# EAGLE design QdecLogic (EAGLE 7.5.0)
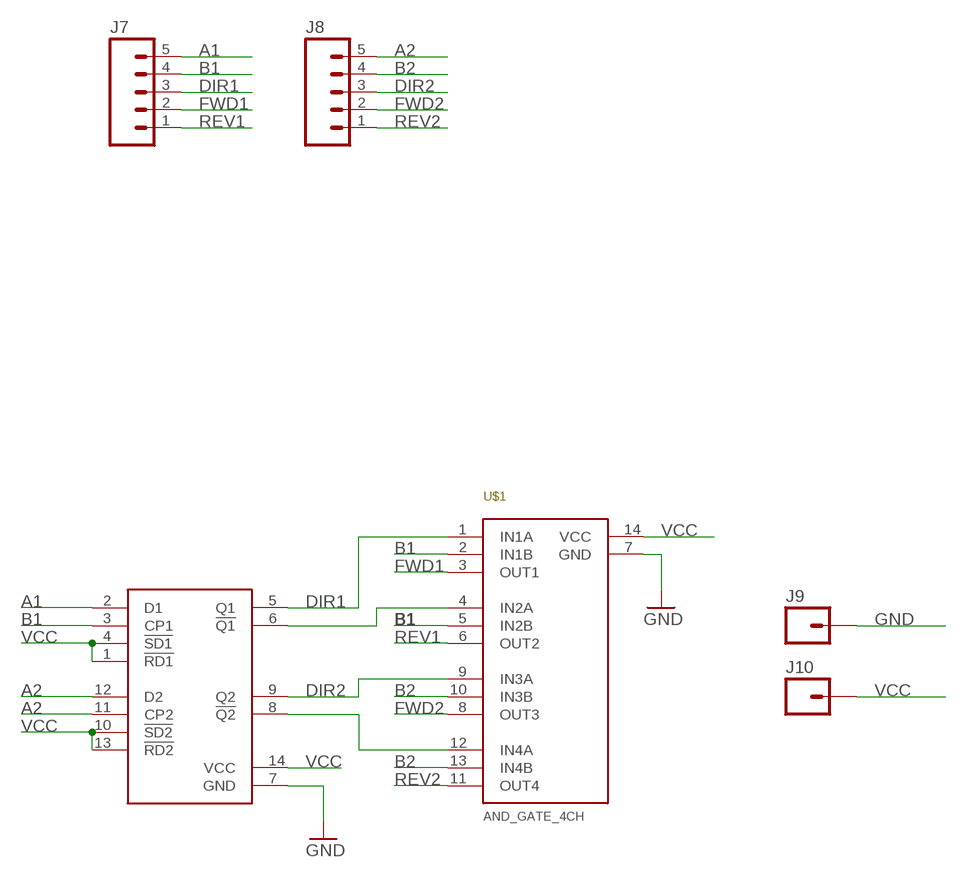
[diagram p0: schematic, sheet 1]

## Parts
J7  M05NO_SILK  [1X05_NO_SILK]
J8  M05NO_SILK  [1X05_NO_SILK]
J9  M01PTH_NO_SILK_YES_STOP  [1X01_NO_SILK]
J10  M01PTH_NO_SILK_YES_STOP  [1X01_NO_SILK]
U$1  AND_GATE_4CH  [14-SOIC]
U$2  FLIPFLOP_D-TYPE_2CH  [14-SOIC]

## Nets
A1: J7.5 U$2.2(D1)
A2: J8.5 U$2.12(D2)
B1: J7.4 U$1.2(IN1B) U$1.5(IN2B) U$2.3(CP1)
B2: J8.4 U$1.10(IN3B) U$1.13(IN4B) U$2.11(CP2)
DIR1: J7.3 U$1.1(IN1A) U$2.5(Q1)
DIR2: J8.3 U$1.9(IN3A) U$2.9(Q2)
FWD1: J7.2 U$1.3(OUT1)
FWD2: J8.2 U$1.8(OUT3)
GND: J9.1 U$1.7(GND) U$2.7(GND)
N$6: U$1.4(IN2A) U$2.6(!Q1)
N$8: U$1.12(IN4A) U$2.8(!Q2)
REV1: J7.1 U$1.6(OUT2)
REV2: J8.1 U$1.11(OUT4)
VCC: J10.1 U$1.14(VCC) U$2.1(!RD1) U$2.4(!SD1) U$2.10(!SD2) U$2.13(!RD2) U$2.14(VCC)

## Library data of the parts
J7 J8 = SparkFun-Connectors:M05: Header 5 Standard 5-pin 0.1" header. Use with straight break away headers (SKU : PRT-00116), right angle break away headers (PRT-00553), swiss pins (PRT-00743), machine pins (PRT-00117), and female headers (PRT-00115). Molex polarized connector foot print use with SKU : PRT-08230 with associated crimp pins and housings.
J9 J10 = SparkFun-Connectors:M01: Header 1 Standard 1-pin 0.1" header. Use with straight break away headers (SKU : PRT-00116), right angle break away headers (PRT-00553), swiss pins (PRT-00743), machine pins (PRT-00117), and female headers (PRT-00115). SMTSO-256-ET is a "flush mount" nut for a 4-40 screw. The older package used to be too tight, and did not allow it to sit properly thru the drill hit. The latest (0.165DIA) fits nice and snug.
U$1 = AmandaEagleLibrary:AND_GATE_4CH
U$2 = AmandaEagleLibrary:FLIPFLOP_D-TYPE_2CH

## Board
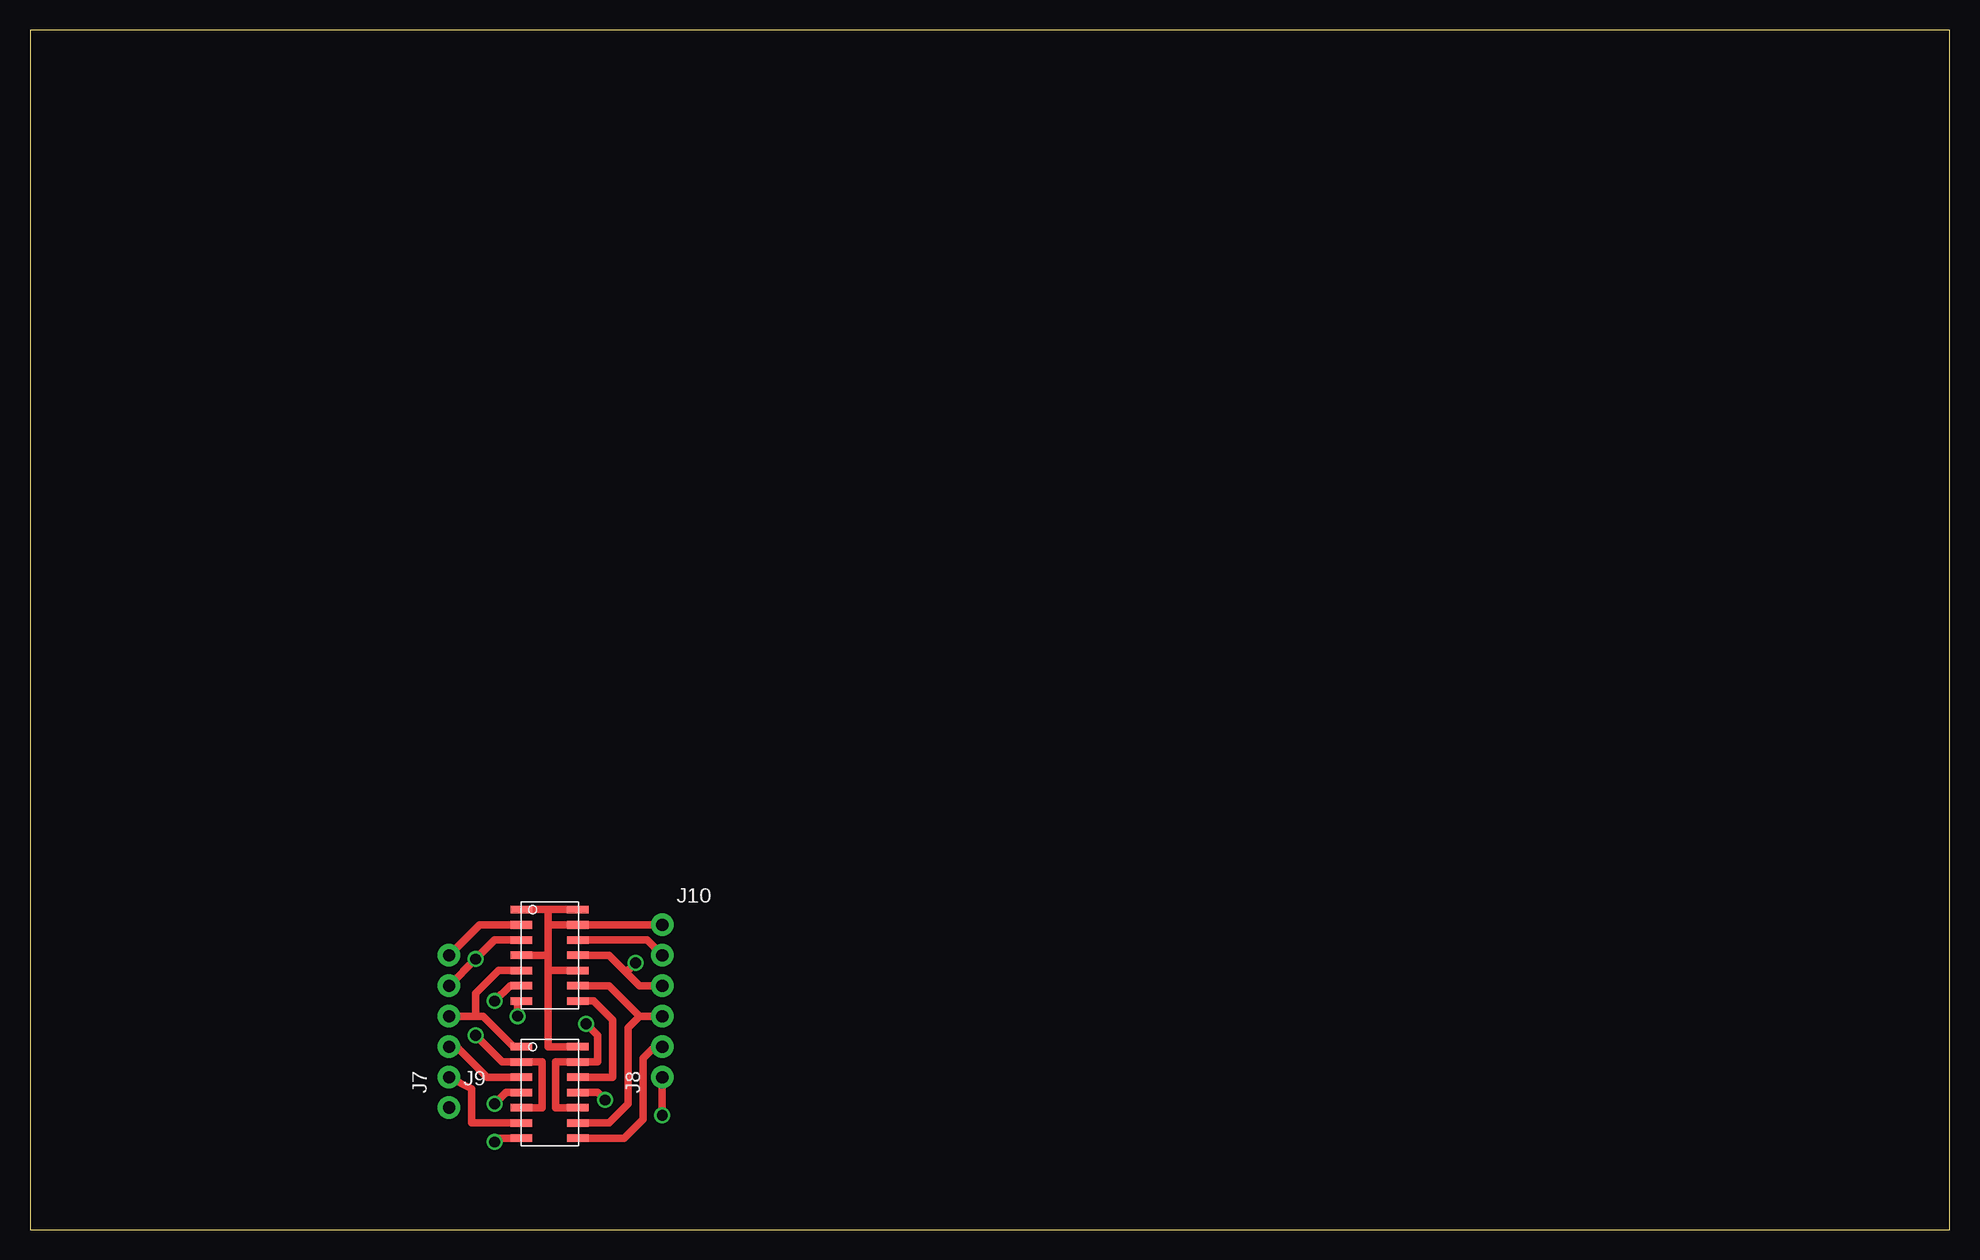
[diagram p1: board, top side]
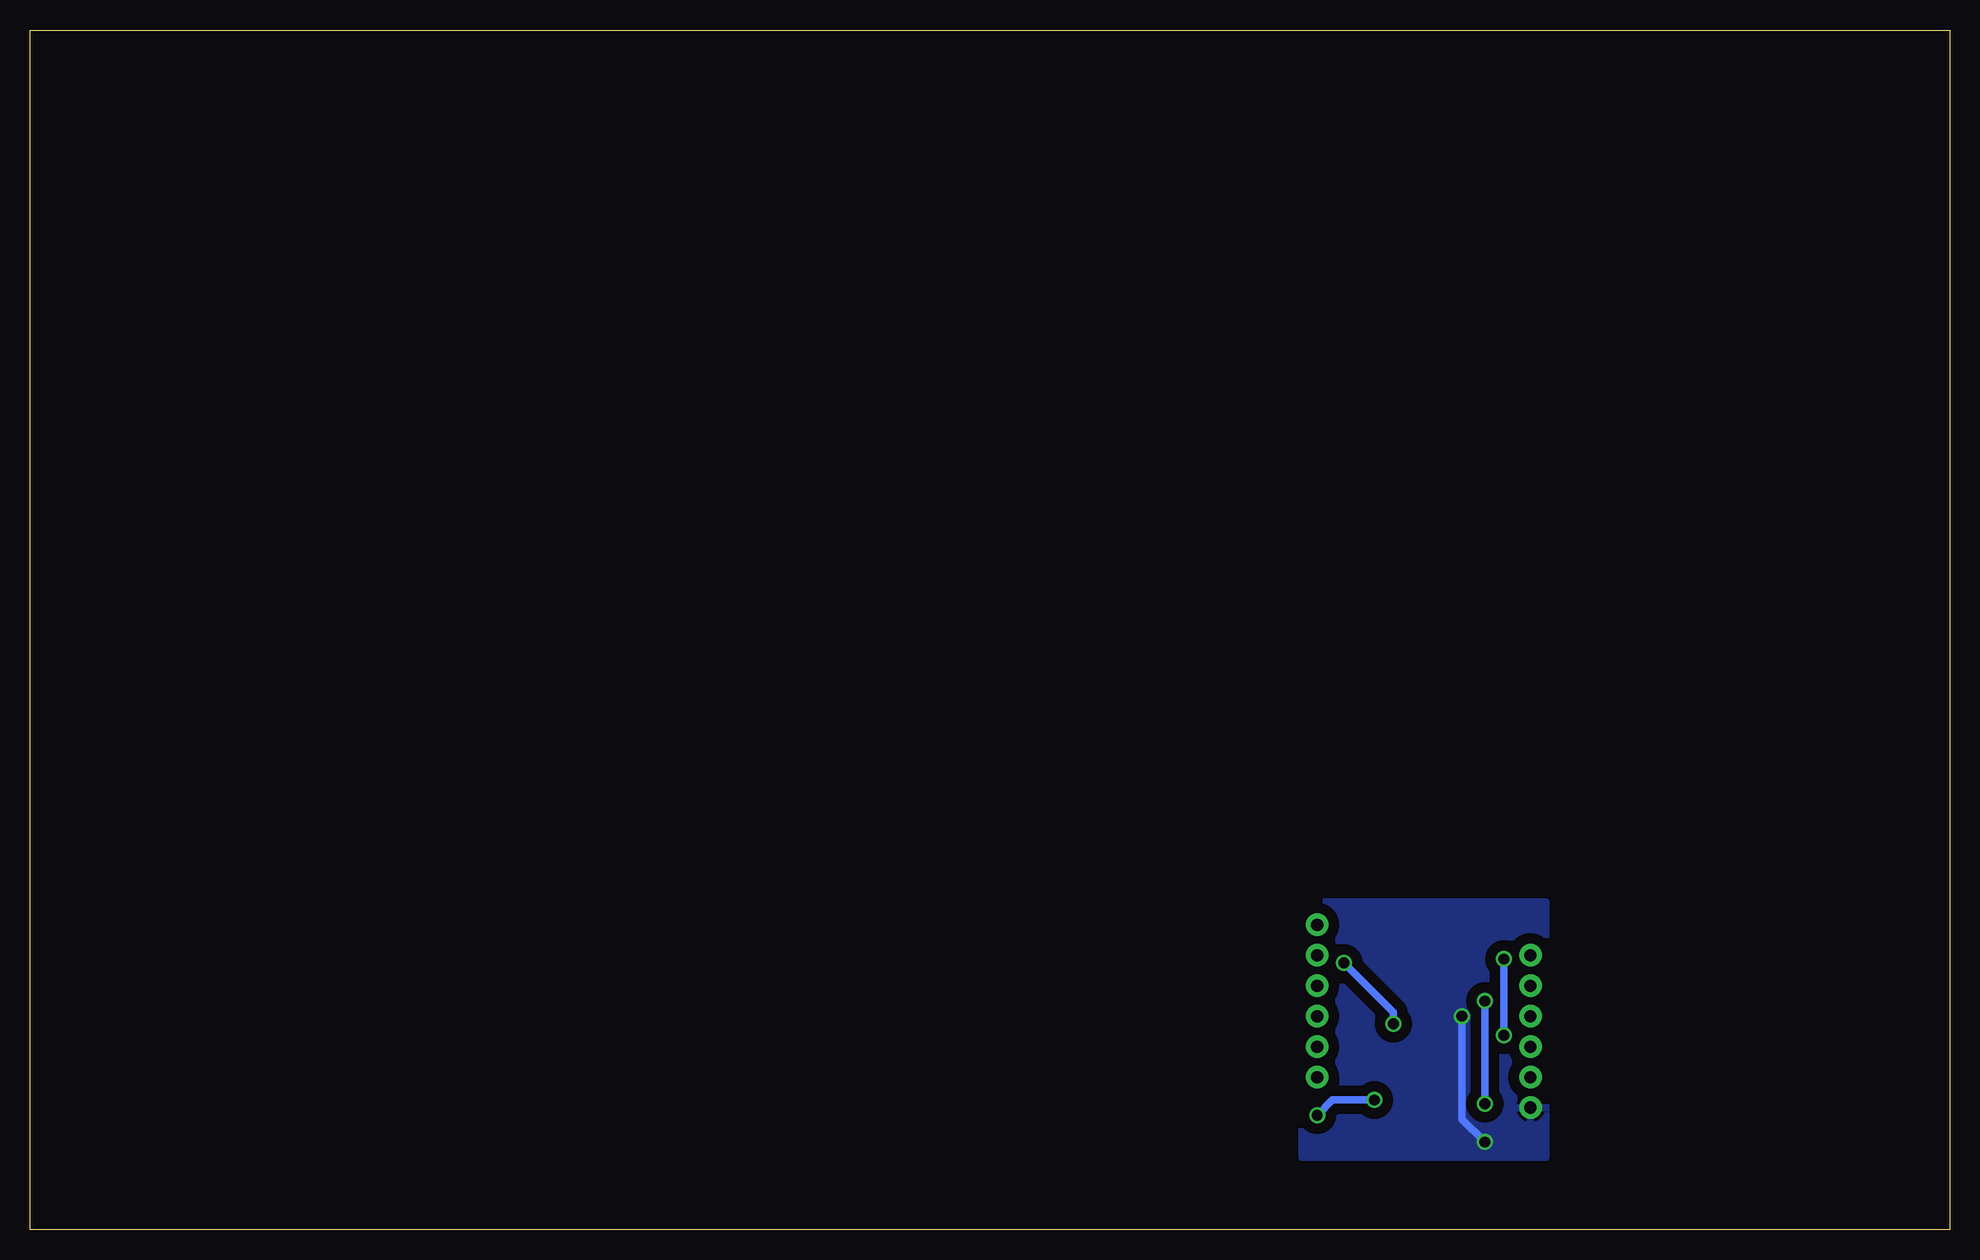
[diagram p2: board, bottom side, seen from below]

Size 160 x 100 mm. Coordinates in mm from the lower left corner, seen from the top.
Outline: 0,0 160,0 160,100 0,100 0,0
Copper layers (1*16): Top 0.035mm / dielectric 1.5mm / Bottom 0.035mm
Design rules "default": minimum track width 10mil, minimum drill 24mil, track to track 8mil, track to pad 8mil, pad to pad 8mil, via to via 8mil, smd to smd 8mil, copper to edge 40mil, drill to drill 8mil, minimum pad ring 10mil, minimum via ring 8mil, stop-mask expansion 4mil, vias tented up to drill 0mil, thermal gap 10mil

### Footprints (pad centres in the part's own frame; a part is rotated, then mirrored left to right if it is on the bottom)
1X05_NO_SILK = drill 1.016 pad 1.88: 1 0,0; 2 2.54,0; 3 5.08,0; 4 7.62,0; 5 10.16,0
1X01_NO_SILK = drill 1.016 pad 1.88: 1 0,0
14-SOIC = smd 1.778 x 0.635: 1 -2.223,3.81; 2 -2.223,2.54; 3 -2.223,1.27; 4 -2.223,0; 5 -2.223,-1.27; 6 -2.223,-2.54; 7 -2.223,-3.81; 8 2.477,-3.81; 9 2.477,-2.54; 10 2.477,-1.27; 11 2.477,0; 12 2.477,1.27; 13 2.477,2.54; 14 2.477,3.81

### Placement (x,y rotation side)
J7  34.92,12.7 90 top
J8  52.7,12.7 90 top
J9  34.92,10.16 0 top
J10  52.7,25.4 0 top
U$1  43.18,11.43 0 top
U$2  43.18,22.86 0 top

### Tracks (layer width: path | path; a pad name or v marks a point on that pad's centre or on a via)
A1
  Top 0.61: U$2.2 37.47,25.4 J7.5
A2
  Top 0.61: U$2.12 51.44,24.13 J8.5
B1  (via drill 0.89 pad 0.89)
  Top 0.61: U$1.5 42.7,10.16 42.7,13.97 U$1.2 39.37,13.97 v37.15,16.19 | U$2.3 38.73,24.13 v37.15,22.54 J7.4
  Bottom 0.61: v37.15,16.19 v37.15,22.54
B2  (via drill 0.89 pad 0.89)
  Top 0.61: U$1.10 43.81,10.16 43.81,13.97 U$1.13 47.31,13.97 47.31,16.19 v46.35,17.14 | U$2.11 48.26,22.86 49.69,21.43 | 49.69,21.43 50.8,20.32 J8.4 | v50.48,22.23 49.69,21.43
  Bottom 0.61: v46.35,17.14 46.35,18.1 v50.48,22.23
DIR1
  Top 0.61: U$1.1 40.32,15.24 37.78,17.78 37.15,17.78 | 37.15,17.78 J7.3 | U$2.5 39.05,21.59 37.15,19.68 37.15,17.78
DIR2
  Top 0.61: U$2.9 48.26,20.32 50.8,17.78 | 50.8,17.78 J8.3 | U$1.9 48.26,8.89 49.85,10.48 49.85,16.83 50.8,17.78
FWD1
  Top 0.61: U$1.3 38.1,12.7 35.56,15.24 J7.2
FWD2
  Top 0.61: U$1.8 49.53,7.62 51.12,9.21 51.12,14.29 52.07,15.24 J8.2
GND  (via drill 0.89, 0.89 pad 0.89)
  Top 0.61: U$2.7 40.64,19.05 v40.64,17.78 | U$1.7 39.05,7.62 v38.73,7.3
  Bottom 0.61: v38.73,7.3 40.64,9.21 v40.64,17.78
  pour Bottom (isolate 0.889): 33.97,27.3 53.98,27.3 53.98,6.03 33.66,6.03 33.66,27.3
N$6  (via drill 0.89 pad 0.89)
  Top 0.61: U$1.4 39.69,11.43 v38.73,10.48 | v38.73,19.05 40.01,20.32 U$2.6
  Bottom 0.61: v38.73,10.48 v38.73,19.05
N$8
  Top 0.61: U$2.8 46.99,19.05 48.58,17.46 48.58,12.7 U$1.12
REV1
  Top 0.61: U$1.6 36.83,8.89 36.83,11.75 J7.1
REV2  (via drill 0.89 pad 0.89)
  Top 0.61: U$1.11 47.31,11.43 v47.94,10.79 | v52.7,9.53 J8.1
  Bottom 0.61: v47.94,10.79 51.44,10.79 v52.7,9.53
VCC
  Top 0.61: U$2.4 43.18,22.86 | 43.18,22.86 43.18,25.4 | 43.18,25.4 U$2.13 J10.1 | 43.18,25.4 43.18,26.67 U$2.1 U$2.14 | 43.18,22.86 43.18,21.59 | 43.18,21.59 43.18,15.24 U$1.14 | U$2.10 43.18,21.59